# Altium schematic sheet Flyback_Converter_New.SchDoc
size A4; SheetNumber: 1; SheetTotal: 1
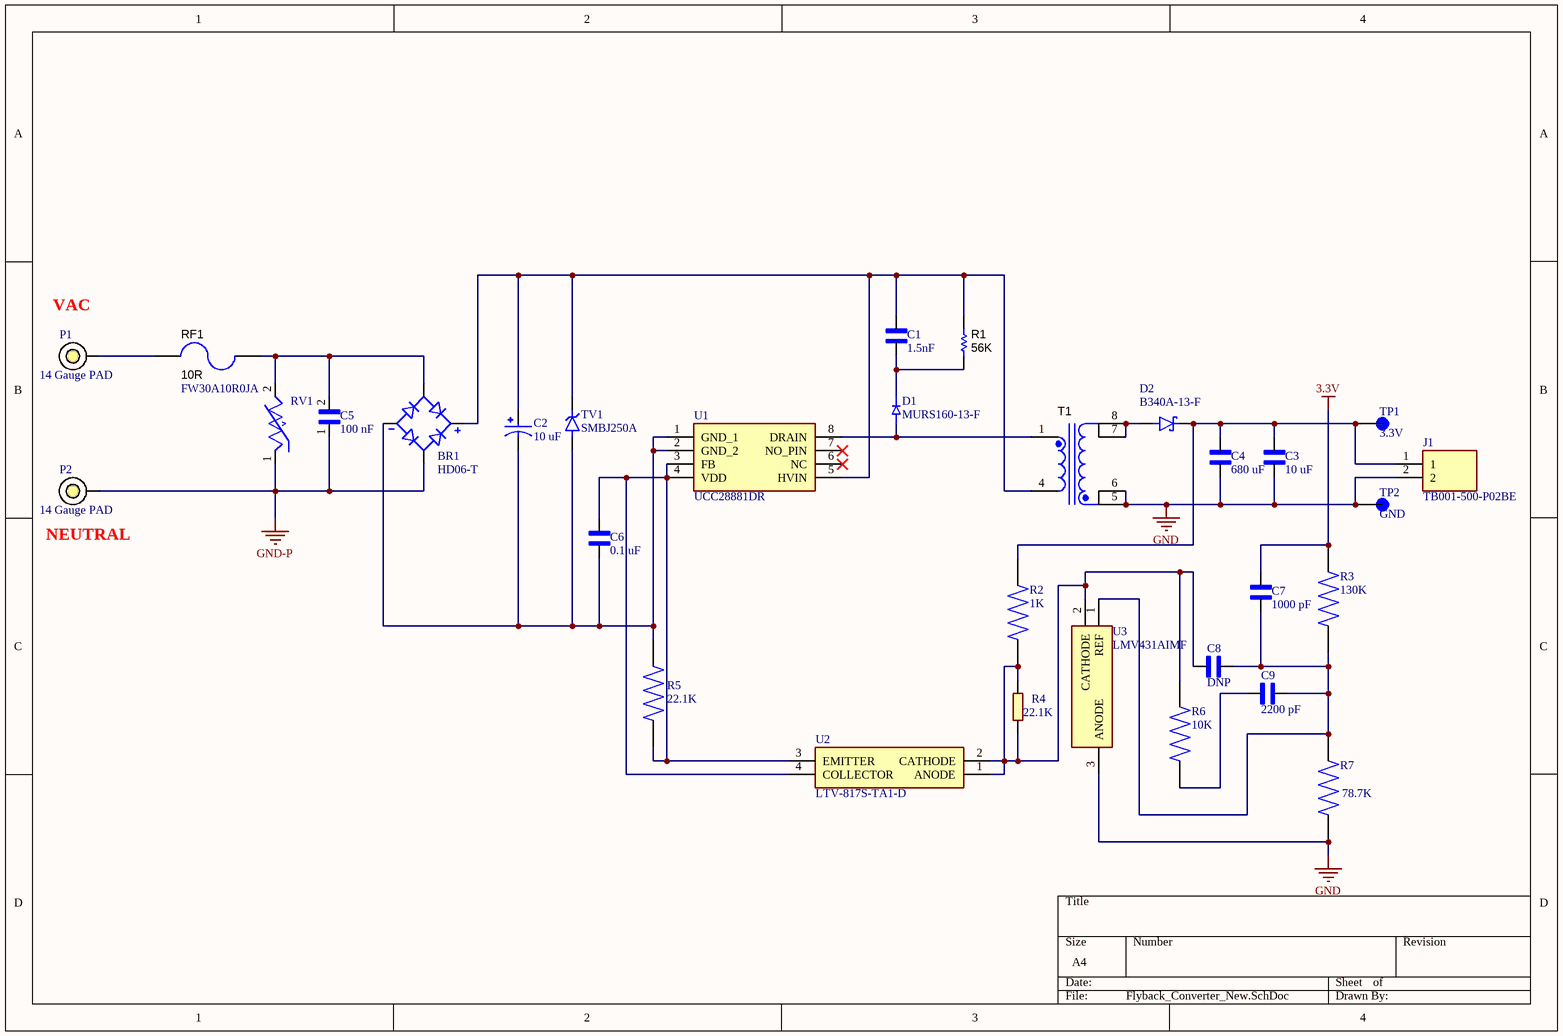
[diagram p0: Flyback_Converter_New.SchDoc]

## Parts
BR1  HD06-T  [DIOB_HD06-T]
C1  1.5nF  [CAPC1608X87N]
C2  10 uF  [450BXW10MEFR10X16 - duplicate]
C3  10 uF  [CAPC1608X120N]
C4  680 uF  [CAPPM7343X310N]
C5  100 nF  [CAPRR1500W60L1750T500H1200]
C6  0.1 uF  [CAPC1608X90N]
C7  1000 pF  [CAPC1608X90N]
C8  DNP  [CAPC1608X95]
C9  2200 pF  [CAPC1608X87N]
D1  MURS160-13-F  [MURS160-13-F]
D2  B340A-13-F  [DIOM5226X240N]
J1  TB001-500-P02BE  [CUI_TB001-500-P02BE]
P1  14 Gauge PAD  [PAD_1.6MM_WIRE]  (no BOM)
P2  14 Gauge PAD  [PAD_1.6MM_WIRE]  (no BOM)
R1  56K  [RESAD2950W85L1150D450]
R2  1K  [RESC1608X55N]
R3  130K  [RES_ERJS03F1303V]
R4  22.1K  [0603]
R5  22.1K  [RES_ERJ3EKF2212V]
R6  10K  [RESC1608X55N]
R7  78.7K  [RES_ERJ3EKF7872V]
RF1  10R  [FKN3WSJT-73-10R]
RV1  (no value)  [B72210P2271K101]
T1  CUSTOM  [TRANSFORMER_EFD20/10/7]  (value not drawn)
TP1  3.3V  [KEYSTONE_5269]
TP2  GND  [KEYSTONE_5269]
TV1  SMBJ250A  [D0-214AA_SMB]
U1  UCC28881DR  [SOIC127P600X175-8N]
U2  LTV-817S-TA1-D  [LTV-817S_LTO]
U3  LMV431AIMF  [SOT-23]

## Nets
3.3V: C7.2 R3.2
GND: C3.1 C4.2 J1.2 R7.1 T1.5 T1.6 TP2.TP U3.3(ANODE)
GND-P: BR1.AC1 C5.1 P2.1 RV1.1
NetBR1_AC2: BR1.AC2 C5.2 RF1.1 RV1.2
NetBR1_NEG: BR1.NEG C2.N C6.1 R5.2 TV1.2(A) U1.1(GND_1) U1.2(GND_2)
NetBR1_POS: BR1.POS C1.2 C2.P R1.2 T1.4 TV1.1(K) U1.5(HVIN)
NetC1_1: C1.1 D1.1(C) R1.1
NetC3_2: C3.2 C4.1 D2.C J1.1 R2.2 TP1.TP
NetC6_2: C6.2 R5.1 U1.3(FB) U1.4(VDD) U2.3(EMITTER) U2.4(COLLECTOR)
NetC7_1: C7.1 C8.1 C9.2 R3.1 R7.2 U3.1(REF)
NetC8_2: C8.2 R2.1 R4.1 R4.2 R6.1 U2.1(ANODE) U2.2(CATHODE) U3.2(CATHODE)
NetC9_1: C9.1 R6.2
NetD1_2: D1.2(A) T1.1 U1.8(DRAIN)
NetD2_A: D2.A T1.7 T1.8
NetP1_1: P1.1 RF1.2

Not connected (* = marked no-connect by the designer): U1 6(NC)* 7(NO_PIN)*

## Notes on the sheet
- (near P1) VAC
- (near P2) NEUTRAL

## Library data of the parts
BR1 = HD06-T: KÃ¶prÃ¼ DoÄŸrultucu Tek FazlÄ± Standart 600 V YÃ¼zey MontajlÄ± 4-MiniDIP; MF: Diodes Inc.; Value: 600V; Price: None; Purchase-URL: https://pricing.snapeda.com/search/part/HD06-T/?ref=eda; Availability: In Stock; Package: SMD-4 Diodes Inc.; Check_prices: https://www.snapeda.com/parts/HD06-T/Diodes+Inc./view-part/?ref=eda; SnapEDA_Link: https://www.snapeda.com/parts/HD06-T/Diodes+Inc./view-part/?ref=snap; MP: HD06-T
C1 = C0603C152K8RACTU: Cap Ceramic 0.0015uF 10V X7R 10% SMD 0603 125Â°C Paper T/R; MF: KEMET; SnapEDA_Link: https://www.snapeda.com/parts/C0603C152K8RACTU/Kemet/view-part/?ref=snap; Package: 603-2 KEMET; Value: *; MP: C0603C152K8RACTU; Check_prices: https://www.snapeda.com/parts/C0603C152K8RACTU/Kemet/view-part/?ref=eda
C2 = 450BXW10MEFR10X16: 10ÂµF 450V Aluminum Electrolytic Capacitors Radial, Can 10000 Hrs @ 105Â°C; MF: Rubycon; Availability: Good; Price: None; Package: Radial Can  Rubycon; MP: 450BXW10MEFR10X16; Value: *; SnapEDA_Link: https://www.snapeda.com/parts/450BXW10MEFR10X16/Rubycon/view-part/4800459/?ref=snap; Check_prices: https://www.snapeda.com/parts/450BXW10MEFR10X16/Rubycon/view-part/4800459/?ref=eda; Purchase-URL: https://pricing.snapeda.com/search/part/450BXW10MEFR10X16/?ref=eda
C3 = ZRB18AR61E106ME01L: SMD capacitor X5R(EIA) with capacitance 10uF Tol.20%. Rated voltage 25Vdc 85C; MF: Murata; SnapEDA_Link: https://www.snapeda.com/parts/ZRB18AR61E106ME01L/Murata/view-part/?ref=snap; Package: 1608 Murata; Value: *; MP: ZRB18AR61E106ME01L; Check_prices: https://www.snapeda.com/parts/ZRB18AR61E106ME01L/Murata/view-part/?ref=eda
C4 = TPME687M006R0023: 680 ÂµF Molded Tantalum Capacitors 6.3 V 2917 (7343 Metric) 23mOhm; MF: AVX; SnapEDA_Link: https://www.snapeda.com/parts/TPME687M006R0023/AVX/view-part/?ref=snap; Package: 2917 AVX; Value: *; MP: TPME687M006R0023; Check_prices: https://www.snapeda.com/parts/TPME687M006R0023/AVX/view-part/?ref=eda
C5 = ECQUAAF104SA: Cap Film Suppression X2 0.1uF 275VAC PP 20% (17.5 X 5 X 12mm) Radial Plastic Rectangular Can 15mm 110C Automotive Bulk; MF: Panasonic; Package: DIP-2 Panasonic; MP: ECQUAAF104SA; Value: *; SnapEDA_Link: https://www.snapeda.com/parts/ECQUAAF104SA/Panasonic/view-part/5794383/?ref=snap; Availability: In Stock; Price: None; Check_prices: https://www.snapeda.com/parts/ECQUAAF104SA/Panasonic/view-part/5794383/?ref=eda
C6 = C0603C104K4RAC: 0.1 ÂµF Â±10% 16V Ceramic Capacitor X7R 0603 (1608 Metric); MF: KEMET; SnapEDA_Link: https://www.snapeda.com/parts/C0603C104K4RAC/KEMET/view-part/?ref=snap; Package: 603-2 KEMET; Value: *; MP: C0603C104K4RAC; Check_prices: https://www.snapeda.com/parts/C0603C104K4RAC/KEMET/view-part/?ref=eda
C7 = 06035A102GAT2A: 0603 1000 pF 50 V Â±2% Tolerance C0G Multilayer Ceramic Capacitor; MF: AVX; SnapEDA_Link: https://www.snapeda.com/parts/06035A102GAT2A/AVX/view-part/?ref=snap; Package: 1608 AVX; Value: *; MP: 06035A102GAT2A; Check_prices: https://www.snapeda.com/parts/06035A102GAT2A/AVX/view-part/?ref=eda
C8 = C1608X7R1C105K: 1 ÂµF Â±10% 16V Ceramic Capacitor X7R 0603 (1608 Metric); MF: TDK; SnapEDA_Link: https://www.snapeda.com/parts/C1608X7R1C105K/TDK/view-part/?ref=snap; Package: 0603 TDK; Value: *; MP: C1608X7R1C105K; Check_prices: https://www.snapeda.com/parts/C1608X7R1C105K/TDK/view-part/?ref=eda
C9 = C0603S222J5RACTU: Cap Cer 2200pf 50v 5% X7r 0603; MF: KEMET; SnapEDA_Link: https://www.snapeda.com/parts/C0603S222J5RACTU/Kemet/view-part/?ref=snap; Package: 1608 KEMET; Value: *; MP: C0603S222J5RACTU; Check_prices: https://www.snapeda.com/parts/C0603S222J5RACTU/Kemet/view-part/?ref=eda
D1 = MURS160-13-F: Diode Switching 600V 1A 2Pin SMB | Diodes Inc MURS160-13-F; MF: Diodes Inc.; SnapEDA_Link: https://www.snapeda.com/parts/MURS160-13-F/Diodes+Inc./view-part/?ref=snap; Package: DO-214 Diodes Inc.; Value: *; MP: MURS160-13-F; Check_prices: https://www.snapeda.com/parts/MURS160-13-F/Diodes+Inc./view-part/?ref=eda
D2 = B340A-13-F: Schottky Diode 3A 40V 0.5Vf SMA | Diodes Inc B340A-13-F; MF: Diodes Inc.; SnapEDA_Link: https://www.snapeda.com/parts/B340A-13-F/Diodes+Inc./view-part/?ref=snap; Package: DO-214 Diodes Inc.; Value: *; MP: B340A-13-F; Check_prices: https://www.snapeda.com/parts/B340A-13-F/Diodes+Inc./view-part/?ref=eda
J1 = TB001-500-P02BE: 2~24 Poles, Screw Type, Horizontal, 5.0 Pitch, 22~12 (AWG), Terminal Block Connector; MF: Same Sky; SnapEDA_Link: https://www.snapeda.com/parts/TB001-500-P02BE/Same+Sky/view-part/?ref=snap; Package: None; Value: *; MP: TB001-500-P02BE; Check_prices: https://www.snapeda.com/parts/TB001-500-P02BE/Same+Sky/view-part/?ref=eda
P1 P2 = 14 Gauge PAD: 5.2MM WIRE PAD; Number: NA; Manufacturer: NA
R1 = CRCW1206100KJNEA: RES 56K OHM 2W 5% AXIAL; Manufacturer: Vishay Beyschlag/Draloric/BC Components; Manufacturer Part Number: PR02000205602JR200; Supplier 1: Digi-Key; Supplier Part Number 1: PPC56KW-2CT-ND; value: 56K
R2 = CR0603-FX-1001ELF: RES SMD 1K OHM 1% 1/10W 0603 / 1 kOhms Â±1% 0.1W, 1/10W Chip Resistor 0603 (1608 Metric) Moisture Resistant Thick Film; MF: Bourns Electronics; MP: CR0603FX1001ELF; SnapEDA_Link: https://www.snapeda.com/parts/CR0603FX1001ELF/Bourns/view-part/?ref=snap; Package: 0603-2 Bourns; Value: *; Check_prices: https://www.snapeda.com/parts/CR0603FX1001ELF/Bourns/view-part/?ref=eda
R3 = ERJS03F1303V: Res Thick Film 0603 130K Ohm 1% 1/10W Â±100ppm/Â°C Molded SMD SMD Punched Carrier T/R; MF: Panasonic; SnapEDA_Link: https://www.snapeda.com/parts/ERJS03F1303V/Panasonic/view-part/?ref=snap; Package: 1608-2 Panasonic; Value: *; MP: ERJS03F1303V; Check_prices: https://www.snapeda.com/parts/ERJS03F1303V/Panasonic/view-part/?ref=eda
R4 = RC0603FR-0722R1L: 22.1 Ohms Â±1% 0.1W, 1/10W Chip Resistor 0603 (1608 Metric) Moisture Resistant Thick Film; MF: Yageo; SnapEDA_Link: https://www.snapeda.com/parts/RC0603FR-0722R1L/Yageo/view-part/?ref=snap; Package: SMD-2 Yageo; Value: *; MP: RC0603FR-0722R1L; Check_prices: https://www.snapeda.com/parts/RC0603FR-0722R1L/Yageo/view-part/?ref=eda
R5 = ERJ3EKF2212V: Resistor Thick Film 0603 22.1k Ohm 1% 1/10 Watt 100ppm C Surface Mount Punched Carrier Tape and Reel; MF: Panasonic; MP: ERJ-3EKF2212V; SnapEDA_Link: https://www.snapeda.com/parts/ERJ-3EKF2212V/Panasonic+Electronic+Components/view-part/?ref=snap; Package: 1608-2 Panasonic; Value: *; Check_prices: https://www.snapeda.com/parts/ERJ-3EKF2212V/Panasonic+Electronic+Components/view-part/?ref=eda
R6 = RK73G1JTTD1002F: Package: None; Price: None; Value: *; MP: RK73G1JTTD1002F; Availability: Unavailable
R7 = ERJ3EKF7872V: Res Thick Film 0603 78.7K Ohm 1% 1/10W 100ppm/C Molded SMD SMD Punched Carrier T/R; MF: Panasonic; MP: ERJ-3EKF7872V; SnapEDA_Link: https://www.snapeda.com/parts/ERJ-3EKF7872V/Panasonic+Electronic+Components/view-part/?ref=snap; Package: 1608-2 Panasonic; Value: *; Check_prices: https://www.snapeda.com/parts/ERJ-3EKF7872V/Panasonic+Electronic+Components/view-part/?ref=eda
RF1 = FW30A10R0JA: Res Fusible Wirewound 10 Ohm 5% 3W ±350ppm/°C Conformal Axial Ammo Pack; Manufacturer: Bourns; Supplier 1: Digi-Key; Supplier Part Number 1: FW30A10R0JACT-ND; RoHS: Yes; Category: Through-Hole Resistors; Stock: 18600; Pricing: 1=0.52000, 10=0.37000, 25=0.28840, 50=0.24380, 100=0.19210, 250=0.16260, 500=0.13302 (USD); Case/Package: Axial; Min Operating Temperature: -40°C; Max Operating Temperature: 155°C; Package Quantity: 1; Packaging: Cut Tape; Value: 10R; Tolerance: 5%; Resistor Type: Wirewound; Number of Terminations: 2; Max Power Dissipation: 3W; Temperature Coefficient: 350ppm/°C; Length: 0.61inch; RoHS Compliant: Yes; ComponentLink1URL: http://www.yageo.com/NewPortal/yageodocoutput?fileName=/pdf/throughhole/Yageo_LR_FKN_2013.pdf&src-supplier=Digi-Key; ComponentLink1Description: http://www.yageo.com/NewPortal/yageodocoutput?fileName=/pdf/throughhole/Yageo_LR_FKN_2013.pdf&src-supplier=Digi-Key; ComponentLink2URL: http://www.yageo.com/documents/recent/Yageo%20LR_FKN_2013.pdf?src-supplier=Digi-Key; ComponentLink2Description: http://www.yageo.com/documents/recent/Yageo%20LR_FKN_2013.pdf?src-supplier=Digi-Key; Manufacturer Part Number: FW30A10R0JA
RV1 = B72210P2271K101: MF: TDK ELECTRONICS; Value: *; Package: None; Check_prices: https://www.snapeda.com/parts/B72210P2271K101/TM+Electronics/view-part/?ref=eda; SnapEDA_Link: https://www.snapeda.com/parts/B72210P2271K101/TM+Electronics/view-part/?ref=snap; MP: B72210P2271K101
T1 = TRANSFORMER: Core Type: EFD20/10/7  Core Material: N49  Turns Ratio(Nps): 69:4; Manufacturer Part Number: CUSTOM; Manufacturer: CUSTOM
TP1 TP2 = 5269: TEST POINT (PURPLE) - MINIATURE; MF: Keystone Electronics; SnapEDA_Link: https://www.snapeda.com/parts/5269/Keystone/view-part/?ref=snap; Package: None; Value: *; MP: 5269; Check_prices: https://www.snapeda.com/parts/5269/Keystone/view-part/?ref=eda
TV1 = SMBJ250A: 405V Clamp 1.5A Ipp Tvs Diode Surface Mount DO-214AA (SMBJ); MF: Littelfuse; SnapEDA_Link: https://www.snapeda.com/parts/SMBJ250A/Littelfuse/view-part/?ref=snap; Package: DO-214 Littelfuse; Value: *; MP: SMBJ250A; Check_prices: https://www.snapeda.com/parts/SMBJ250A/Littelfuse/view-part/?ref=eda
U1 = UCC28881DR: 700-V Lowest Quiescent Current Off-Line Switcher; Manufacturer_Name: Texas Instruments; Geometry.Height: 1.75mm; Manufacturer_Part_Number: UCC28881DR; Mouser Part Number: 595-UCC28881DR; Mouser Price/Stock: https://www.mouser.co.uk/ProductDetail/Texas-Instruments/UCC28881DR?qs=8%2FmU9qzJpL9X%252BEjLm6T16Q%3D%3D; Arrow Part Number: UCC28881DR; Arrow Price/Stock: https://www.arrow.com/en/products/ucc28881dr/texas-instruments; Datasheet Link: http://www.ti.com/lit/ds/symlink/ucc28881.pdf
U2 = LTV-817S-TA1-D: Transistor Output Optocouplers Optocoupler 50% 5kv 4Pin SMT Voltage - Output (Max) 35V Current - Output / Channel 50mA Voltage - Forward (Vf) (Typ) 1.2V Current - DC Forward (If) (Max) 50 mA Vce Saturation (Max) 200mV Operating Temperature -55C ~ 110C; Manufacturer_Name: Lite-On; Geometry.Height: 4.6mm; Manufacturer_Part_Number: LTV-817S-TA1-D; Mouser Part Number: 859-LTV-817S-TA1-D; Mouser Price/Stock: https://www.mouser.co.uk/ProductDetail/LITEON/LTV-817S-TA1-D?qs=WAWaI72GHKywq5dxGALi%252BQ%3D%3D; Arrow Part Number: LTV-817S-TA1-D; Arrow Price/Stock: https://www.arrow.com/en/products/ltv-817s-ta1-d/lite-on-technology.html?utm_currency=USD&region=nac; Datasheet Link: http://optoelectronics.liteon.com/upload/download/DS-70-96-0016/LTV-8X7%20series%20201610%20.pdf
U3 = LMV431AIMF: Voltage References NRND, alternate is LMV431AIMF/NOPB; Manufacturer_Name: Texas Instruments; Geometry.Height: 1.12mm; Manufacturer_Part_Number: LMV431AIMF; Mouser Part Number: 926-LMV431AIMF; Mouser Price/Stock: https://www.mouser.co.uk/ProductDetail/Texas-Instruments/LMV431AIMF?qs=7lkVKPoqpbZM%2FlKYz0jxmQ%3D%3D; Arrow Part Number: LMV431AIMF; Arrow Price/Stock: https://www.arrow.com/en/products/lmv431aimf/texas-instruments?utm_currency=USD&region=nac; Datasheet Link: http://www.ti.com/lit/ds/symlink/lmv431.pdf